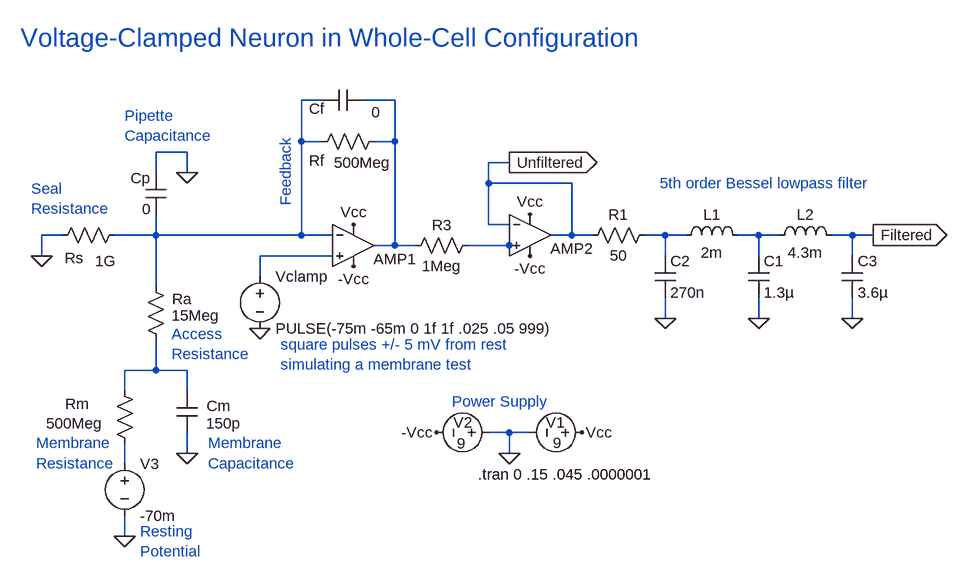
[diagram p0: schematic voltage-clamp.asc]
voltage-clamp.asc, the LTspice schematic file:
Version 4
SHEET 1 1492 692
WIRE 400 -16 368 -16
WIRE 512 -16 464 -16
WIRE 368 48 368 -16
WIRE 400 48 368 48
WIRE 512 48 512 -16
WIRE 512 48 480 48
WIRE 192 64 144 64
WIRE 688 80 656 80
WIRE 144 96 144 64
WIRE 192 96 192 64
WIRE 656 112 656 80
WIRE 784 112 656 112
WIRE 656 176 656 112
WIRE 688 176 656 176
WIRE 0 192 -32 192
WIRE 144 192 144 160
WIRE 144 192 80 192
WIRE 368 192 368 48
WIRE 368 192 144 192
WIRE 416 192 368 192
WIRE 784 192 784 112
WIRE 784 192 752 192
WIRE 816 192 784 192
WIRE 928 192 896 192
WIRE 960 192 928 192
WIRE 1072 192 1040 192
WIRE 1104 192 1072 192
WIRE 1216 192 1184 192
WIRE 1248 192 1216 192
WIRE 512 208 512 48
WIRE 512 208 480 208
WIRE 544 208 512 208
WIRE 688 208 624 208
WIRE 704 208 688 208
WIRE -32 224 -32 192
WIRE 416 224 304 224
WIRE 928 224 928 192
WIRE 1072 224 1072 192
WIRE 1216 224 1216 192
WIRE 304 256 304 224
WIRE 144 272 144 192
WIRE 928 320 928 288
WIRE 1072 320 1072 288
WIRE 1216 320 1216 288
WIRE 144 400 144 352
WIRE 144 400 96 400
WIRE 192 400 144 400
WIRE 96 432 96 400
WIRE 192 432 192 400
WIRE 688 496 656 496
WIRE 720 496 688 496
WIRE 192 528 192 496
WIRE 688 528 688 496
WIRE 96 544 96 512
WIRE 96 656 96 624
FLAG 800 496 Vcc
FLAG 448 176 Vcc
FLAG 448 240 -Vcc
FLAG 576 496 -Vcc
FLAG 304 336 0
FLAG 192 528 0
FLAG 192 96 0
FLAG 688 528 0
FLAG -32 224 0
FLAG 1072 320 0
FLAG 928 320 0
FLAG 1216 320 0
FLAG 96 656 0
FLAG 720 224 -Vcc
FLAG 720 160 Vcc
FLAG 1248 192 Filtered
IOPIN 1248 192 Out
FLAG 688 80 Unfiltered
IOPIN 688 80 Out
SYMBOL res 496 32 R90
WINDOW 0 61 104 VBottom 2
WINDOW 3 33 34 VTop 2
SYMATTR InstName Rf
SYMATTR Value 500Meg
SYMBOL voltage 816 496 R90
WINDOW 0 -16 42 VRight 2
WINDOW 3 16 47 VRight 2
WINDOW 123 0 0 Left 0
WINDOW 39 0 0 Left 0
SYMATTR InstName V1
SYMATTR Value 9
SYMBOL OpAmps\\UniversalOpamp2 448 208 R0
WINDOW 0 31 21 Left 2
SYMATTR InstName AMP1
SYMBOL voltage 672 496 R90
WINDOW 0 -16 41 VRight 2
WINDOW 3 17 51 VRight 2
WINDOW 123 0 0 Left 0
WINDOW 39 0 0 Left 0
SYMATTR InstName V2
SYMATTR Value 9
SYMBOL voltage 304 240 R0
WINDOW 123 0 0 Left 0
WINDOW 39 0 0 Left 0
SYMATTR InstName Vclamp
SYMATTR Value PULSE(-75m -65m 0 1f 1f .025 .05 999)
SYMBOL res 128 256 R0
WINDOW 0 41 34 Left 2
WINDOW 3 40 60 Left 2
SYMATTR InstName Ra
SYMATTR Value 15Meg
SYMBOL cap 176 432 R0
WINDOW 0 46 23 Left 2
WINDOW 3 45 50 Left 2
SYMATTR InstName Cm
SYMATTR Value 150p
SYMBOL res 80 416 R0
WINDOW 0 -76 36 Left 2
WINDOW 3 -105 66 Left 2
SYMATTR InstName Rm
SYMATTR Value 500Meg
SYMBOL cap 160 160 R180
WINDOW 0 24 56 Left 2
WINDOW 3 24 8 Left 2
SYMATTR InstName Cp
SYMATTR Value 0
SYMBOL res 912 176 R90
WINDOW 0 0 56 VBottom 2
WINDOW 3 32 56 VTop 2
SYMATTR InstName R1
SYMATTR Value 50
SYMBOL res -16 208 R270
WINDOW 0 -35 34 VTop 2
WINDOW 3 -8 83 VBottom 2
SYMATTR InstName Rs
SYMATTR Value 1G
SYMBOL cap 464 -32 R90
WINDOW 0 45 72 VBottom 2
WINDOW 3 19 -19 VTop 2
SYMATTR InstName Cf
SYMATTR Value 0
SYMBOL ind 944 208 R270
WINDOW 0 32 56 VTop 2
WINDOW 3 5 56 VBottom 2
SYMATTR InstName L1
SYMATTR Value 2m
SYMBOL cap 1056 224 R0
SYMATTR InstName C1
SYMATTR Value 1.3µ
SYMBOL ind 1088 208 R270
WINDOW 0 32 56 VTop 2
WINDOW 3 5 56 VBottom 2
SYMATTR InstName L2
SYMATTR Value 4.3m
SYMBOL cap 912 224 R0
SYMATTR InstName C2
SYMATTR Value 270n
SYMBOL cap 1200 224 R0
SYMATTR InstName C3
SYMATTR Value 3.6µ
SYMBOL voltage 96 528 R0
WINDOW 123 0 0 Left 0
WINDOW 39 0 0 Left 0
SYMATTR InstName V3
SYMATTR Value -70m
SYMBOL OpAmps\\UniversalOpamp2 720 192 R0
WINDOW 0 31 21 Left 2
SYMATTR InstName AMP2
SYMBOL res 640 192 R90
WINDOW 0 0 56 VBottom 2
WINDOW 3 32 56 VTop 2
SYMATTR InstName R3
SYMATTR Value 1Meg
TEXT 336 360 Left 2 ;square pulses +/- 5 mV from rest\nsimulating a membrane test
TEXT 96 8 Left 2 ;Pipette\nCapacitance
TEXT 168 344 Left 2 ;Access\nResistance
TEXT -40 512 Left 2 ;Membrane\nResistance
TEXT 224 512 Left 2 ;Membrane\nCapacitance
TEXT 600 448 Left 2 ;Power Supply
TEXT 344 40 VRight 2 ;Feedback
TEXT -64 -112 Left 4 ;Voltage-Clamped Neuron in Whole-Cell Configuration
TEXT 640 560 Left 2 !.tran 0 .15 .045 .0000001
TEXT -48 120 Left 2 ;Seal\nResistance
TEXT 920 112 Left 2 ;5th order Bessel lowpass filter
TEXT 120 648 Left 2 ;Resting\nPotential

The netlist it stands for:
* voltage-clamp.asc
Rf N002 N001 500Meg
V1 Vcc 0 9
XAMP1 N006 N001 Vcc -Vcc N002 level.2 Avol=1Meg GBW=10Meg Slew=10Meg ilimit=25m rail=0 Vos=0 phimargin=45 en=0 enk=0 in=0 ink=0 Rin=500Meg  ; pins IN+ IN- V+ V- OUT
V2 0 -Vcc 9
Vclamp N006 0 PULSE(-75m -65m 0 1f 1f .025 .05 999)
Ra N001 N007 15Meg
Cm N007 0 150p
Rm N007 N008 500Meg
Cp N001 0 0
R1 N003 Unfiltered 50
Rs 0 N001 1G
Cf N002 N001 0
L1 N003 N004 2m
C1 N004 0 1.3µ
L2 N004 Filtered 4.3m
C2 N003 0 270n
C3 Filtered 0 3.6µ
V3 N008 0 -70m
XAMP2 N005 Unfiltered Vcc -Vcc Unfiltered level.2 Avol=1Meg GBW=10Meg Slew=10Meg ilimit=25m rail=0 Vos=0 phimargin=45 en=0 enk=0 in=0 ink=0 Rin=500Meg  ; pins IN+ IN- V+ V- OUT
R3 N005 N002 1Meg
* square pulses +/- 5 mV from rest
* simulating a membrane test
* Pipette
* Capacitance
* Access
* Resistance
* Membrane
* Resistance
* Membrane
* Capacitance
* Power Supply
* Feedback
* Voltage-Clamped Neuron in Whole-Cell Configuration
.tran 0 .15 .045 .0000001
* Seal
* Resistance
* 5th order Bessel lowpass filter
* Resting
* Potential
.lib UniversalOpamps2.sub
.backanno
.end

* Results of the author's LTspice run, read from the files saved beside the schematic
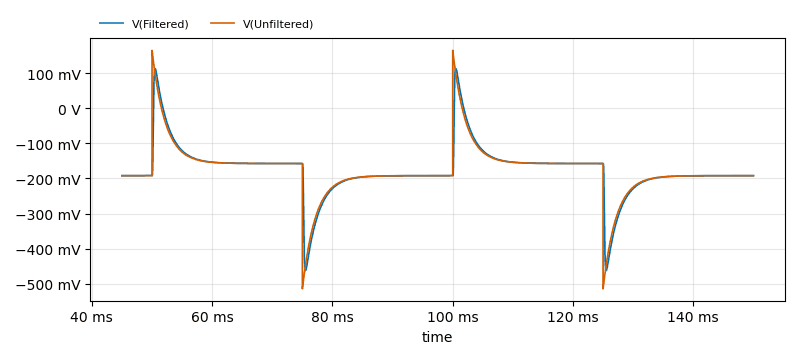
[diagram p1: Transient Analysis of voltage-clamp.asc, plotted from the saved traces]
* Transient Analysis, 1 run:
*   V(Filtered): min -462.4 mV, max 113.1 mV, average -175.5 mV, rms 189.9 mV, last -192 mV
*   V(Unfiltered): min -514.3 mV, max 165 mV, average -175.5 mV, rms 190.7 mV, last -192 mV